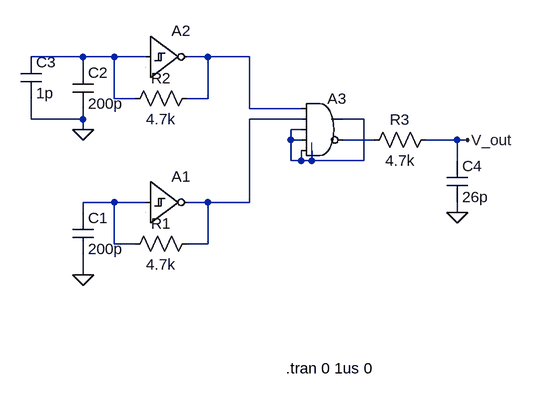
[diagram p0: schematic 20070523.asc]
20070523.asc, the LTspice schematic file:
Version 4
SHEET 1 904 756
WIRE 16 0 -64 0
WIRE 64 0 16 0
WIRE 112 0 64 0
WIRE 208 0 176 0
WIRE 272 0 208 0
WIRE 16 16 16 0
WIRE 64 64 64 0
WIRE 96 64 64 64
WIRE 208 64 208 0
WIRE 208 64 176 64
WIRE 272 80 272 0
WIRE 352 80 272 80
WIRE -64 96 -64 64
WIRE 16 96 16 80
WIRE 16 96 -64 96
WIRE 352 96 272 96
WIRE 448 96 416 96
WIRE 16 112 16 96
WIRE 352 112 336 112
WIRE 336 128 336 112
WIRE 352 128 336 128
WIRE 464 128 416 128
WIRE 592 128 544 128
WIRE 608 128 592 128
WIRE 336 160 336 128
WIRE 352 160 352 144
WIRE 352 160 336 160
WIRE 368 160 368 144
WIRE 368 160 352 160
WIRE 448 160 448 96
WIRE 448 160 368 160
WIRE 592 160 592 128
WIRE 64 224 16 224
WIRE 112 224 64 224
WIRE 208 224 176 224
WIRE 272 224 272 96
WIRE 272 224 208 224
WIRE 16 240 16 224
WIRE 592 240 592 224
WIRE 64 288 64 224
WIRE 96 288 64 288
WIRE 208 288 208 224
WIRE 208 288 176 288
WIRE 16 336 16 304
FLAG 16 336 0
FLAG 16 112 0
FLAG 608 128 V_out
FLAG 592 240 0
SYMBOL Digital\\schmtinv 112 160 R0
WINDOW 3 -71 111 Invisible 0
SYMATTR Value Vhigh=3, Vt=1.35, Vh=0.3, trise=20n, tfall=20n
SYMATTR InstName A1
SYMBOL res 192 272 R90
WINDOW 0 0 56 VBottom 0
WINDOW 3 32 56 VTop 0
SYMATTR InstName R1
SYMATTR Value 4.7k
SYMBOL cap 0 240 R0
SYMATTR InstName C1
SYMATTR Value 200p
SYMBOL Digital\\schmtinv 112 -64 R0
WINDOW 3 -71 111 Invisible 0
SYMATTR Value Vhigh=3, Vt=1.35, Vh=0.3, trise=20n, tfall=20n
SYMATTR InstName A2
SYMBOL res 192 48 R90
WINDOW 0 0 56 VBottom 0
WINDOW 3 32 56 VTop 0
SYMATTR InstName R2
SYMATTR Value 4.7k
SYMBOL cap 0 16 R0
SYMATTR InstName C2
SYMATTR Value 200p
SYMBOL cap -80 0 R0
SYMATTR InstName C3
SYMATTR Value 1p
SYMBOL Digital\\and 384 48 R0
WINDOW 3 0 0 Invisible 0
SYMATTR Value trise=20n, tfall=20n, Vt=1.35
SYMATTR InstName A3
SYMBOL cap 576 160 R0
SYMATTR InstName C4
SYMATTR Value 26p
SYMBOL res 560 112 R90
WINDOW 0 0 56 VBottom 0
WINDOW 3 32 56 VTop 0
SYMATTR InstName R3
SYMATTR Value 4.7k
TEXT 328 480 Left 0 !.tran 0 1us 0

The netlist it stands for:
* 20070523.asc
A1 N006 0 0 0 0 N003 0 0 SCHMITT Vhigh=3, Vt=1.35, Vh=0.3, trise=20n, tfall=20n
R1 N003 N006 4.7k
C1 N006 0 200p
A2 N001 0 0 0 0 N002 0 0 SCHMITT Vhigh=3, Vt=1.35, Vh=0.3, trise=20n, tfall=20n
R2 N002 N001 4.7k
C2 N001 0 200p
C3 N001 0 1p
A3 N002 N003 N004 N004 N004 N005 N004 N004 AND trise=20n, tfall=20n, Vt=1.35
C4 V_out 0 26p
R3 V_out N005 4.7k
.tran 0 1us 0
.backanno
.end